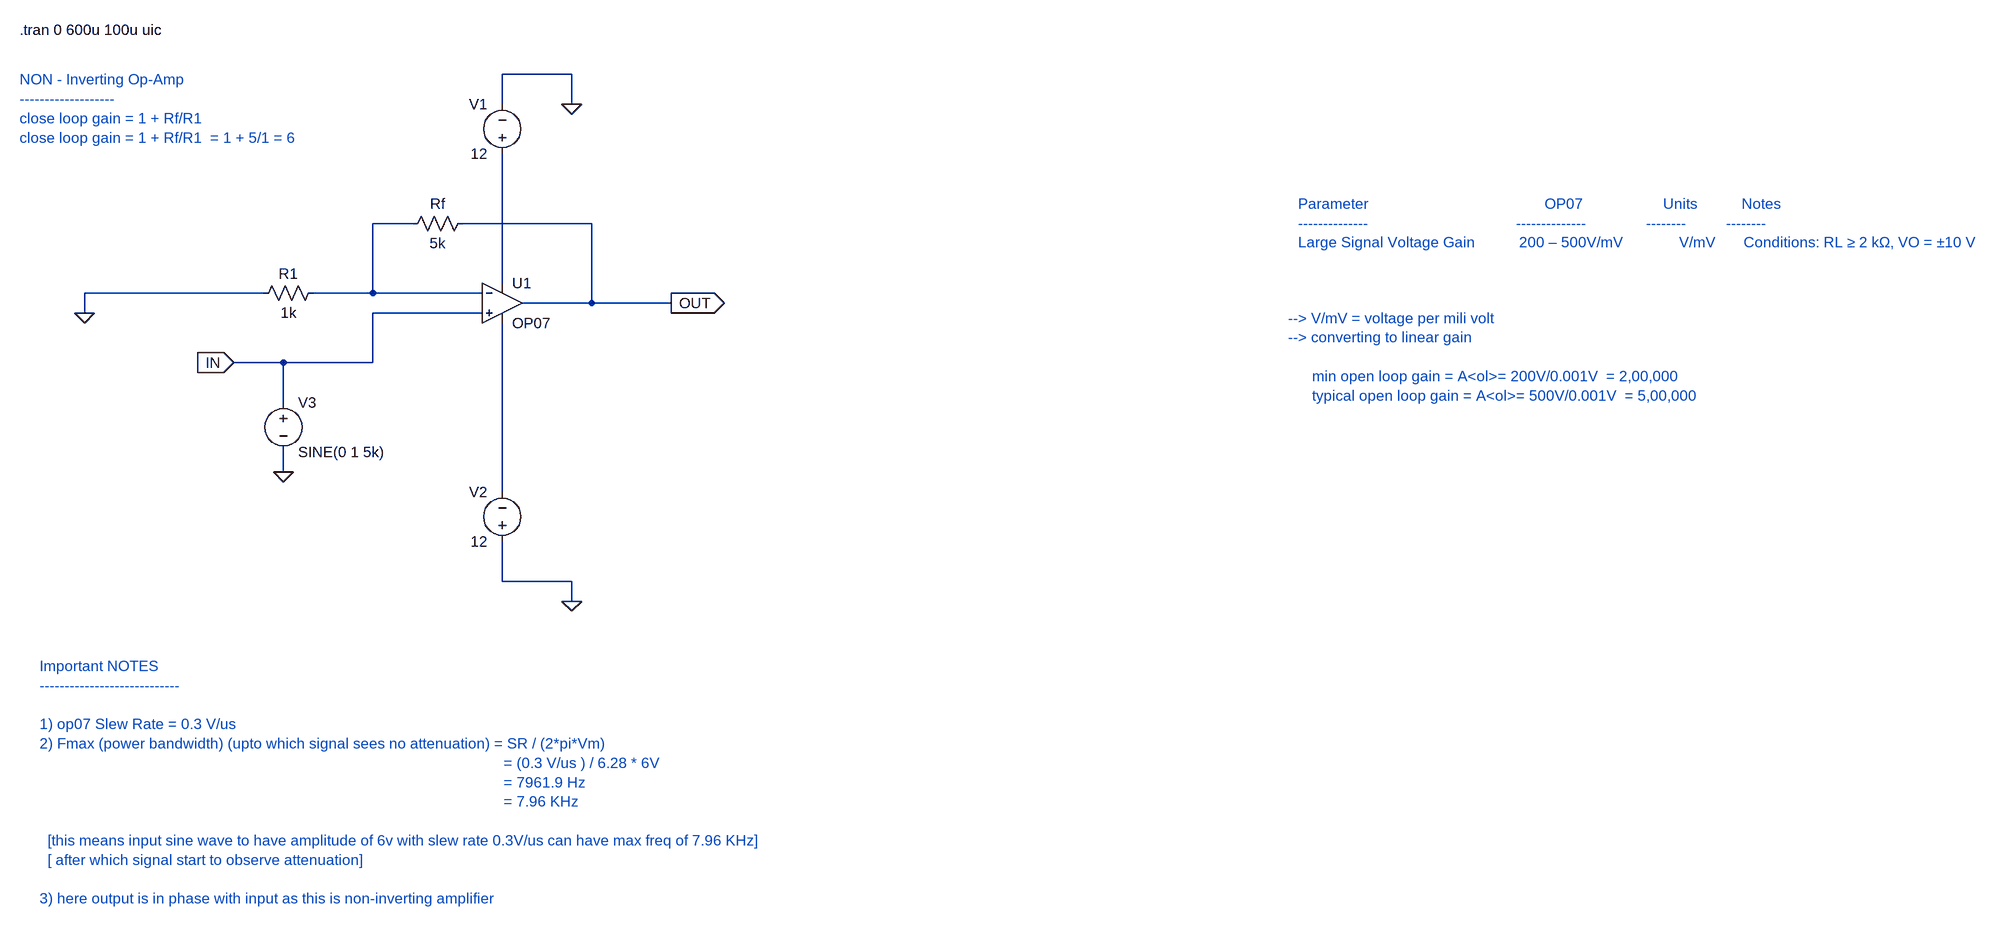
[diagram p0: schematic close_loop_NON_inverting_amplifier_with_AC_input.asc]
close_loop_NON_inverting_amplifier_with_AC_input.asc, the LTspice schematic file:
Version 4.1
SHEET 1 2948 1016
WIRE 192 -288 80 -288
WIRE 80 -240 80 -288
WIRE 192 -240 192 -288
WIRE -64 -48 -128 -48
WIRE 224 -48 16 -48
WIRE 80 48 80 -160
WIRE -304 64 -592 64
WIRE -128 64 -128 -48
WIRE -128 64 -224 64
WIRE 48 64 -128 64
WIRE 224 80 224 -48
WIRE 224 80 112 80
WIRE 352 80 224 80
WIRE -592 96 -592 64
WIRE 48 96 -128 96
WIRE -272 176 -352 176
WIRE -128 176 -128 96
WIRE -128 176 -272 176
WIRE -272 240 -272 176
WIRE -272 352 -272 320
WIRE 80 384 80 112
WIRE 80 528 80 464
WIRE 192 528 80 528
WIRE 192 560 192 528
FLAG 192 -240 0
FLAG 192 560 0
FLAG -272 352 0
FLAG 352 80 OUT
IOPIN 352 80 Out
FLAG -592 96 0
FLAG -352 176 IN
IOPIN -352 176 In
SYMBOL voltage 80 -144 R180
WINDOW 0 24 96 Left 2
WINDOW 3 24 16 Left 2
WINDOW 123 0 0 Left 0
WINDOW 39 0 0 Left 0
SYMATTR InstName V1
SYMATTR Value 12
SYMBOL voltage 80 480 R180
WINDOW 0 24 96 Left 2
WINDOW 3 24 16 Left 2
WINDOW 123 0 0 Left 0
WINDOW 39 0 0 Left 0
SYMATTR InstName V2
SYMATTR Value 12
SYMBOL OpAmps\\OP07 80 16 R0
SYMATTR InstName U1
SYMBOL res -208 48 R90
WINDOW 0 0 56 VBottom 2
WINDOW 3 32 56 VTop 2
SYMATTR InstName R1
SYMATTR Value 1k
SYMBOL res 32 -64 R90
WINDOW 0 0 56 VBottom 2
WINDOW 3 32 56 VTop 2
SYMATTR InstName Rf
SYMATTR Value 5k
SYMBOL voltage -272 224 R0
WINDOW 123 0 0 Left 0
WINDOW 39 0 0 Left 0
SYMATTR InstName V3
SYMATTR Value SINE(0 1 5k)
TEXT 1360 -80 Left 2 ;Parameter                                            OP07                    Units           Notes\n--------------                                     --------------               --------          --------\nLarge Signal Voltage Gain           200 – 500V/mV              V/mV       Conditions: RL ≥ 2 kΩ, VO = ±10 V
TEXT 1344 104 Left 2 ;--> V/mV = voltage per mili volt\n--> converting to linear gain\n \n      min open loop gain = A<ol>= 200V/0.001V  = 2,00,000\n      typical open loop gain = A<ol>= 500V/0.001V  = 5,00,000
TEXT -696 -360 Left 2 !.tran 0 600u 100u uic
TEXT -696 -280 Left 2 ;NON - Inverting Op-Amp\n-------------------\nclose loop gain = 1 + Rf/R1\nclose loop gain = 1 + Rf/R1  = 1 + 5/1 = 6
TEXT -664 664 Left 2 ;Important NOTES\n----------------------------\n \n1) op07 Slew Rate = 0.3 V/us\n2) Fmax (power bandwidth) (upto which signal sees no attenuation) = SR / (2*pi*Vm)  \n                                                                                                                    = (0.3 V/us ) / 6.28 * 6V \n                                                                                                                    = 7961.9 Hz \n                                                                                                                    = 7.96 KHz\n \n  [this means input sine wave to have amplitude of 6v with slew rate 0.3V/us can have max freq of 7.96 KHz]\n  [ after which signal start to observe attenuation]\n \n3) here output is in phase with input as this is non-inverting amplifier

The netlist it stands for:
* close_loop_NON_inverting_amplifier_with_AC_input.asc
V1 N002 0 12
V2 0 N003 12
X§U1 IN N001 N002 N003 OUT LT1001  ; OP07, pins In+ In- V+ V- OUT
R1 N001 0 1k
Rf OUT N001 5k
V3 IN 0 SINE(0 1 5k)
* Parameter                                            OP07                    Units           Notes
* --------------                                     --------------               --------          --------
* Large Signal Voltage Gain           200 – 500V/mV              V/mV       Conditions: RL ≥ 2 kΩ, VO = ±10 V
* --> V/mV = voltage per mili volt
* --> converting to linear gain
*       min open loop gain = A<ol>= 200V/0.001V  = 2,00,000
*       typical open loop gain = A<ol>= 500V/0.001V  = 5,00,000
.tran 0 600u 100u uic
* NON - Inverting Op-Amp
* -------------------
* close loop gain = 1 + Rf/R1
* close loop gain = 1 + Rf/R1  = 1 + 5/1 = 6
* Important NOTES
* ----------------------------
* 1) op07 Slew Rate = 0.3 V/us
* 2) Fmax (power bandwidth) (upto which signal sees no attenuation) = SR / (2*pi*Vm)
*                                                                                                                     = (0.3 V/us ) / 6.28 * 6V
*                                                                                                                     = 7961.9 Hz
*                                                                                                                     = 7.96 KHz
*   [this means input sine wave to have amplitude of 6v with slew rate 0.3V/us can have max freq of 7.96 KHz]
*   [ after which signal start to observe attenuation]
* 3) here output is in phase with input as this is non-inverting amplifier
.lib LTC.lib
.backanno
.end

* Results of the author's LTspice run, read from the files saved beside the schematic
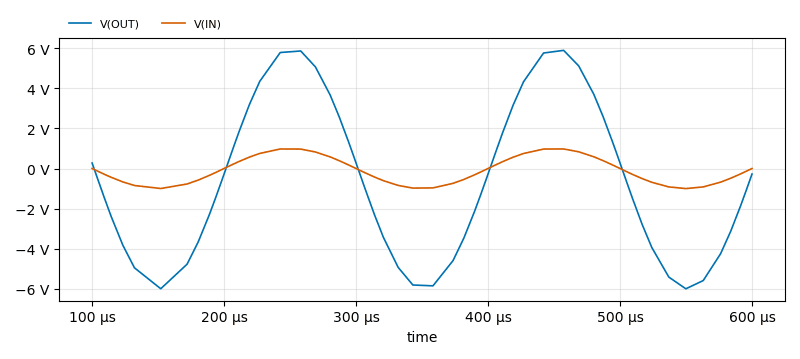
[diagram p1: Transient Analysis of close_loop_NON_inverting_amplifier_with_AC_input.asc, plotted from the saved traces]
* Transient Analysis, 1 run:
*   V(OUT): min -5.993 V, max 5.885 V, average -747.3 mV, rms 4.194 V, last -274.9 mV
*   V(IN): min -1 V, max 973.9 mV, average -124.8 mV, rms 699.5 mV, last 0 V